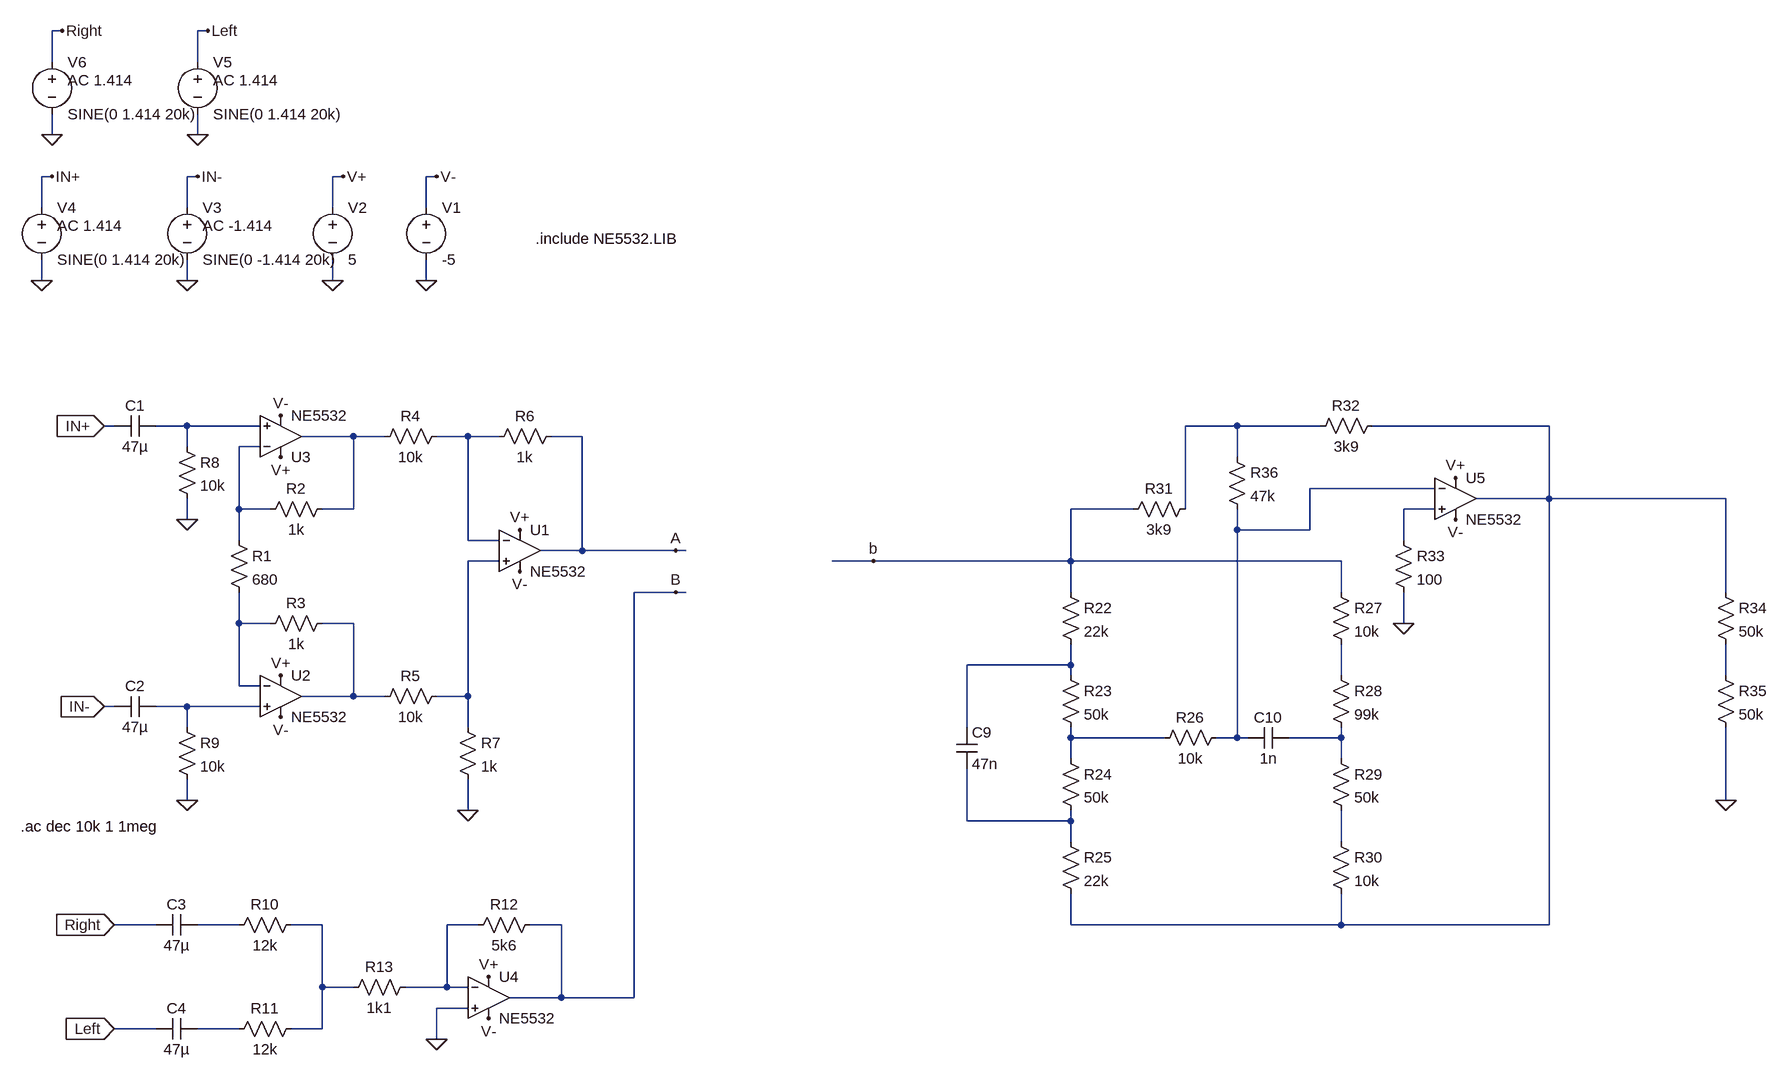
[diagram p0: schematic Entrada.asc]
Entrada.asc, the LTspice schematic file:
Version 4
SHEET 1 3648 1096
WIRE -1216 -512 -1232 -512
WIRE -992 -512 -1008 -512
WIRE -1232 -464 -1232 -512
WIRE -1008 -464 -1008 -512
WIRE -1232 -352 -1232 -384
WIRE -1008 -352 -1008 -384
WIRE -1232 -288 -1248 -288
WIRE -1008 -288 -1024 -288
WIRE -784 -288 -800 -288
WIRE -640 -288 -656 -288
WIRE -1248 -240 -1248 -288
WIRE -1024 -240 -1024 -288
WIRE -800 -240 -800 -288
WIRE -656 -240 -656 -288
WIRE -1248 -128 -1248 -160
WIRE -1024 -128 -1024 -160
WIRE -800 -128 -800 -160
WIRE -656 -128 -656 -160
WIRE -1136 96 -1152 96
WIRE -1024 96 -1072 96
WIRE -912 96 -1024 96
WIRE 592 96 512 96
WIRE 720 96 592 96
WIRE 1072 96 800 96
WIRE -768 112 -848 112
WIRE -720 112 -768 112
WIRE -592 112 -640 112
WIRE -544 112 -592 112
WIRE -416 112 -464 112
WIRE -1024 128 -1024 96
WIRE -912 128 -944 128
WIRE 592 144 592 96
WIRE 896 192 704 192
WIRE 1072 208 1072 96
WIRE 1072 208 960 208
WIRE 1344 208 1072 208
WIRE -944 224 -944 128
WIRE -896 224 -944 224
WIRE -768 224 -768 112
WIRE -768 224 -816 224
WIRE 432 224 336 224
WIRE 512 224 512 96
WIRE 896 224 848 224
WIRE -1024 240 -1024 208
WIRE 592 256 592 224
WIRE 704 256 704 192
WIRE 704 256 592 256
WIRE -944 272 -944 224
WIRE -592 272 -592 112
WIRE -544 272 -592 272
WIRE 848 272 848 224
WIRE -416 288 -416 112
WIRE -416 288 -480 288
WIRE -272 288 -416 288
WIRE -256 288 -272 288
WIRE -544 304 -592 304
WIRE 32 304 -32 304
WIRE 336 304 336 224
WIRE 336 304 32 304
WIRE 752 304 336 304
WIRE -272 352 -336 352
WIRE -256 352 -272 352
WIRE 336 352 336 304
WIRE 752 352 752 304
WIRE 1344 352 1344 208
WIRE -944 400 -944 352
WIRE -896 400 -944 400
WIRE -768 400 -816 400
WIRE 848 400 848 352
WIRE 336 464 336 432
WIRE 336 464 176 464
WIRE 336 480 336 464
WIRE 752 480 752 432
WIRE 1344 480 1344 432
WIRE -944 496 -944 400
WIRE -912 496 -944 496
WIRE -768 512 -768 400
WIRE -768 512 -848 512
WIRE -720 512 -768 512
WIRE -592 512 -592 304
WIRE -592 512 -640 512
WIRE -1136 528 -1152 528
WIRE -1024 528 -1072 528
WIRE -912 528 -1024 528
WIRE -1024 560 -1024 528
WIRE -592 560 -592 512
WIRE 176 560 176 464
WIRE 336 576 336 560
WIRE 480 576 336 576
WIRE 592 576 592 256
WIRE 592 576 560 576
WIRE 608 576 592 576
WIRE 752 576 752 560
WIRE 752 576 672 576
WIRE 336 608 336 576
WIRE 752 608 752 576
WIRE -1024 672 -1024 640
WIRE 1344 672 1344 560
WIRE -592 688 -592 640
WIRE 176 704 176 624
WIRE 336 704 336 688
WIRE 336 704 176 704
WIRE 336 736 336 704
WIRE 752 736 752 688
WIRE -1072 864 -1136 864
WIRE -944 864 -1008 864
WIRE -816 864 -864 864
WIRE -576 864 -624 864
WIRE -448 864 -496 864
WIRE 336 864 336 816
WIRE 752 864 752 816
WIRE 752 864 336 864
WIRE 1072 864 1072 208
WIRE 1072 864 752 864
WIRE -816 960 -816 864
WIRE -768 960 -816 960
WIRE -624 960 -624 864
WIRE -624 960 -688 960
WIRE -592 960 -624 960
WIRE -448 976 -448 864
WIRE -448 976 -528 976
WIRE -336 976 -336 352
WIRE -336 976 -448 976
WIRE -592 992 -640 992
WIRE -1072 1024 -1136 1024
WIRE -944 1024 -1008 1024
WIRE -816 1024 -816 960
WIRE -816 1024 -864 1024
WIRE -640 1040 -640 992
FLAG -592 688 0
FLAG -800 -128 0
FLAG -656 -128 0
FLAG -784 -288 V+
FLAG -640 -288 V-
FLAG -880 80 V-
FLAG -880 544 V-
FLAG -880 144 V+
FLAG -880 480 V+
FLAG -512 256 V+
FLAG -512 320 V-
FLAG -1152 96 IN+
IOPIN -1152 96 In
FLAG -1152 528 IN-
IOPIN -1152 528 In
FLAG -1248 -128 0
FLAG -1024 -128 0
FLAG -1232 -288 IN+
FLAG -1008 -288 IN-
FLAG -1024 240 0
FLAG -1024 672 0
FLAG -1136 864 Right
IOPIN -1136 864 In
FLAG -1136 1024 Left
IOPIN -1136 1024 In
FLAG -1232 -352 0
FLAG -1008 -352 0
FLAG -1216 -512 Right
FLAG -992 -512 Left
FLAG -560 1008 V-
FLAG -560 944 V+
FLAG -640 1040 0
FLAG -272 288 A
FLAG -272 352 B
FLAG 848 400 0
FLAG 928 176 V+
FLAG 928 240 V-
FLAG 1344 672 0
FLAG 32 304 b
SYMBOL res -960 256 R0
SYMATTR InstName R1
SYMATTR Value 680
SYMBOL res -800 208 R90
WINDOW 0 0 56 VBottom 2
WINDOW 3 32 56 VTop 2
SYMATTR InstName R2
SYMATTR Value 1k
SYMBOL res -800 384 R90
WINDOW 0 0 56 VBottom 2
WINDOW 3 32 56 VTop 2
SYMATTR InstName R3
SYMATTR Value 1k
SYMBOL res -624 96 R90
WINDOW 0 0 56 VBottom 2
WINDOW 3 32 56 VTop 2
SYMATTR InstName R4
SYMATTR Value 10k
SYMBOL res -624 496 R90
WINDOW 0 0 56 VBottom 2
WINDOW 3 32 56 VTop 2
SYMATTR InstName R5
SYMATTR Value 10k
SYMBOL res -448 96 R90
WINDOW 0 0 56 VBottom 2
WINDOW 3 32 56 VTop 2
SYMATTR InstName R6
SYMATTR Value 1k
SYMBOL res -608 544 R0
SYMATTR InstName R7
SYMATTR Value 1k
SYMBOL voltage -656 -256 R0
WINDOW 123 0 0 Left 0
WINDOW 39 0 0 Left 0
SYMATTR InstName V1
SYMATTR Value -5
SYMBOL voltage -800 -256 R0
WINDOW 123 0 0 Left 0
WINDOW 39 0 0 Left 0
SYMATTR InstName V2
SYMATTR Value 5
SYMBOL cap -1072 80 R90
WINDOW 0 0 32 VBottom 2
WINDOW 3 32 32 VTop 2
SYMATTR InstName C1
SYMATTR Value 47µ
SYMBOL cap -1072 512 R90
WINDOW 0 0 32 VBottom 2
WINDOW 3 32 32 VTop 2
SYMATTR InstName C2
SYMATTR Value 47µ
SYMBOL voltage -1024 -256 R0
WINDOW 123 24 44 Left 2
WINDOW 39 0 0 Left 0
SYMATTR Value2 AC -1.414
SYMATTR InstName V3
SYMATTR Value SINE(0 -1.414 20k)
SYMBOL voltage -1248 -256 R0
WINDOW 123 24 44 Left 2
WINDOW 39 0 0 Left 0
SYMATTR Value2 AC 1.414
SYMATTR InstName V4
SYMATTR Value SINE(0 1.414 20k)
SYMBOL res -1040 112 R0
SYMATTR InstName R8
SYMATTR Value 10k
SYMBOL res -1040 544 R0
SYMATTR InstName R9
SYMATTR Value 10k
SYMBOL res -848 848 R90
WINDOW 0 0 56 VBottom 2
WINDOW 3 32 56 VTop 2
SYMATTR InstName R10
SYMATTR Value 12k
SYMBOL res -848 1008 R90
WINDOW 0 0 56 VBottom 2
WINDOW 3 32 56 VTop 2
SYMATTR InstName R11
SYMATTR Value 12k
SYMBOL cap -1008 848 R90
WINDOW 0 0 32 VBottom 2
WINDOW 3 32 32 VTop 2
SYMATTR InstName C3
SYMATTR Value 47µ
SYMBOL cap -1008 1008 R90
WINDOW 0 0 32 VBottom 2
WINDOW 3 32 32 VTop 2
SYMATTR InstName C4
SYMATTR Value 47µ
SYMBOL voltage -1008 -480 R0
WINDOW 123 24 44 Left 2
WINDOW 39 0 0 Left 0
SYMATTR Value2 AC 1.414
SYMATTR InstName V5
SYMATTR Value SINE(0 1.414 20k)
SYMBOL voltage -1232 -480 R0
WINDOW 123 24 44 Left 2
WINDOW 39 0 0 Left 0
SYMATTR Value2 AC 1.414
SYMATTR InstName V6
SYMATTR Value SINE(0 1.414 20k)
SYMBOL res -480 848 R90
WINDOW 0 0 56 VBottom 2
WINDOW 3 32 56 VTop 2
SYMATTR InstName R12
SYMATTR Value 5k6
SYMBOL res -672 944 R90
WINDOW 0 0 56 VBottom 2
WINDOW 3 32 56 VTop 2
SYMATTR InstName R13
SYMATTR Value 1k1
SYMBOL res 320 336 R0
SYMATTR InstName R22
SYMATTR Value 22k
SYMBOL res 320 464 R0
SYMATTR InstName R23
SYMATTR Value 50k
SYMBOL res 320 592 R0
SYMATTR InstName R24
SYMATTR Value 50k
SYMBOL res 320 720 R0
SYMATTR InstName R25
SYMATTR Value 22k
SYMBOL cap 160 560 R0
SYMATTR InstName C9
SYMATTR Value 47n
SYMBOL res 576 560 R90
WINDOW 0 0 56 VBottom 2
WINDOW 3 32 56 VTop 2
SYMATTR InstName R26
SYMATTR Value 10k
SYMBOL cap 672 560 R90
WINDOW 0 0 32 VBottom 2
WINDOW 3 32 32 VTop 2
SYMATTR InstName C10
SYMATTR Value 1n
SYMBOL res 736 336 R0
SYMATTR InstName R27
SYMATTR Value 10k
SYMBOL res 736 464 R0
SYMATTR InstName R28
SYMATTR Value 99k
SYMBOL res 736 592 R0
SYMATTR InstName R29
SYMATTR Value 50k
SYMBOL res 736 720 R0
SYMATTR InstName R30
SYMATTR Value 10k
SYMBOL res 528 208 R90
WINDOW 0 0 56 VBottom 2
WINDOW 3 32 56 VTop 2
SYMATTR InstName R31
SYMATTR Value 3k9
SYMBOL res 816 80 R90
WINDOW 0 0 56 VBottom 2
WINDOW 3 32 56 VTop 2
SYMATTR InstName R32
SYMATTR Value 3k9
SYMBOL res 832 256 R0
SYMATTR InstName R33
SYMATTR Value 100
SYMBOL res 1328 336 R0
SYMATTR InstName R34
SYMATTR Value 50k
SYMBOL res 1328 464 R0
SYMATTR InstName R35
SYMATTR Value 50k
SYMBOL res 576 128 R0
SYMATTR InstName R36
SYMATTR Value 47k
SYMBOL Opamps\\opamp2 -512 224 R0
SYMATTR InstName U1
SYMATTR Value NE5532
SYMBOL Opamps\\opamp2 -880 448 R0
SYMATTR InstName U2
SYMATTR Value NE5532
SYMBOL Opamps\\opamp2 -880 176 M180
SYMATTR InstName U3
SYMATTR Value NE5532
SYMBOL Opamps\\opamp2 -560 912 R0
SYMATTR InstName U4
SYMATTR Value NE5532
SYMBOL Opamps\\opamp2 928 144 R0
SYMATTR InstName U5
SYMATTR Value NE5532
TEXT -488 -192 Left 2 !.include NE5532.LIB
TEXT -1280 712 Left 2 !.ac dec 10k 1 1meg

The netlist it stands for:
* Entrada.asc
R1 N006 N010 680
R2 N004 N006 1k
R3 N011 N010 1k
R4 N005 N004 10k
R5 N009 N011 10k
R6 A N005 1k
R7 N009 0 1k
V1 V- 0 -5
V2 V+ 0 5
C1 N001 IN+ 47µ
C2 N015 IN- 47µ
V3 IN- 0 SINE(0 -1.414 20k) AC -1.414
V4 IN+ 0 SINE(0 1.414 20k) AC 1.414
R8 N001 0 10k
R9 N015 0 10k
R10 N021 N020 12k
R11 N021 N023 12k
C3 N020 Right 47µ
C4 N023 Left 47µ
V5 Left 0 SINE(0 1.414 20k) AC 1.414
V6 Right 0 SINE(0 1.414 20k) AC 1.414
R12 B N022 5k6
R13 N022 N021 1k1
R22 B N012 22k
R23 N012 N016 50k
R24 N016 N018 50k
R25 N018 N003 22k
C9 N012 N018 47n
R26 N007 N016 10k
C10 N017 N007 1n
R27 B N013 10k
R28 N013 N017 99k
R29 N017 N019 50k
R30 N019 N003 10k
R31 N002 B 3k9
R32 N003 N002 3k9
R33 N008 0 100
R34 N003 N014 50k
R35 N014 0 50k
R36 N002 N007 47k
XU1 N009 N005 V+ V- A NE5532  ; pins In+ In- V+ V- OUT
XU2 N015 N010 V+ V- N011 NE5532  ; pins In+ In- V+ V- OUT
XU3 N001 N006 V+ V- N004 NE5532  ; pins In+ In- V+ V- OUT
XU4 0 N022 V+ V- B NE5532  ; pins In+ In- V+ V- OUT
XU5 N008 N007 V+ V- N003 NE5532  ; pins In+ In- V+ V- OUT
.include NE5532.LIB
.ac dec 10k 1 1meg
.backanno
.end